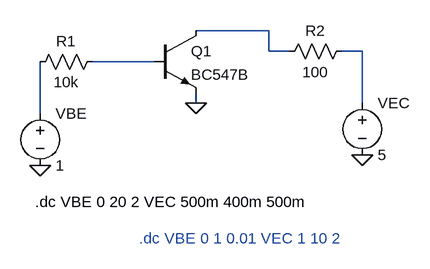
[diagram p0: schematic bjt.asc]
bjt.asc, the LTspice schematic file:
Version 4
SHEET 1 880 680
WIRE 320 80 208 80
WIRE 320 112 320 80
WIRE 352 112 320 112
WIRE 464 112 432 112
WIRE 144 128 48 128
WIRE 208 192 208 176
WIRE 464 192 464 112
WIRE -32 208 -32 128
FLAG -32 288 0
FLAG 208 192 0
FLAG 464 272 0
SYMBOL npn 144 80 R0
SYMATTR InstName Q1
SYMATTR Value BC547B
SYMBOL res -48 144 R270
WINDOW 0 32 56 VTop 2
WINDOW 3 0 56 VBottom 2
SYMATTR InstName R1
SYMATTR Value 10k
SYMBOL voltage -32 192 R0
SYMATTR InstName VBE
SYMATTR Value 1
SYMBOL res 448 96 R90
WINDOW 0 0 56 VBottom 2
WINDOW 3 32 56 VTop 2
SYMATTR InstName R2
SYMATTR Value 100
SYMBOL voltage 464 176 R0
SYMATTR InstName VEC
SYMATTR Value 5
TEXT -40 344 Left 2 !.dc VBE 0 20 2 VEC 500m 400m 500m
TEXT 120 400 Left 2 ;.dc VBE 0 1 0.01 VEC 1 10 2

The netlist it stands for:
* bjt.asc
Q1 N001 N003 0 0 BC547B
R1 N004 N003 10k
VBE N004 0 1
R2 N002 N001 100
VEC N002 0 5
.model NPN NPN
.model PNP PNP
.lib standard.bjt
.dc VBE 0 20 2 VEC 500m 400m 500m
* .dc VBE 0 1 0.01 VEC 1 10 2
.backanno
.end